# EAGLE design pqc-rev2 (EAGLE 9.0.1)
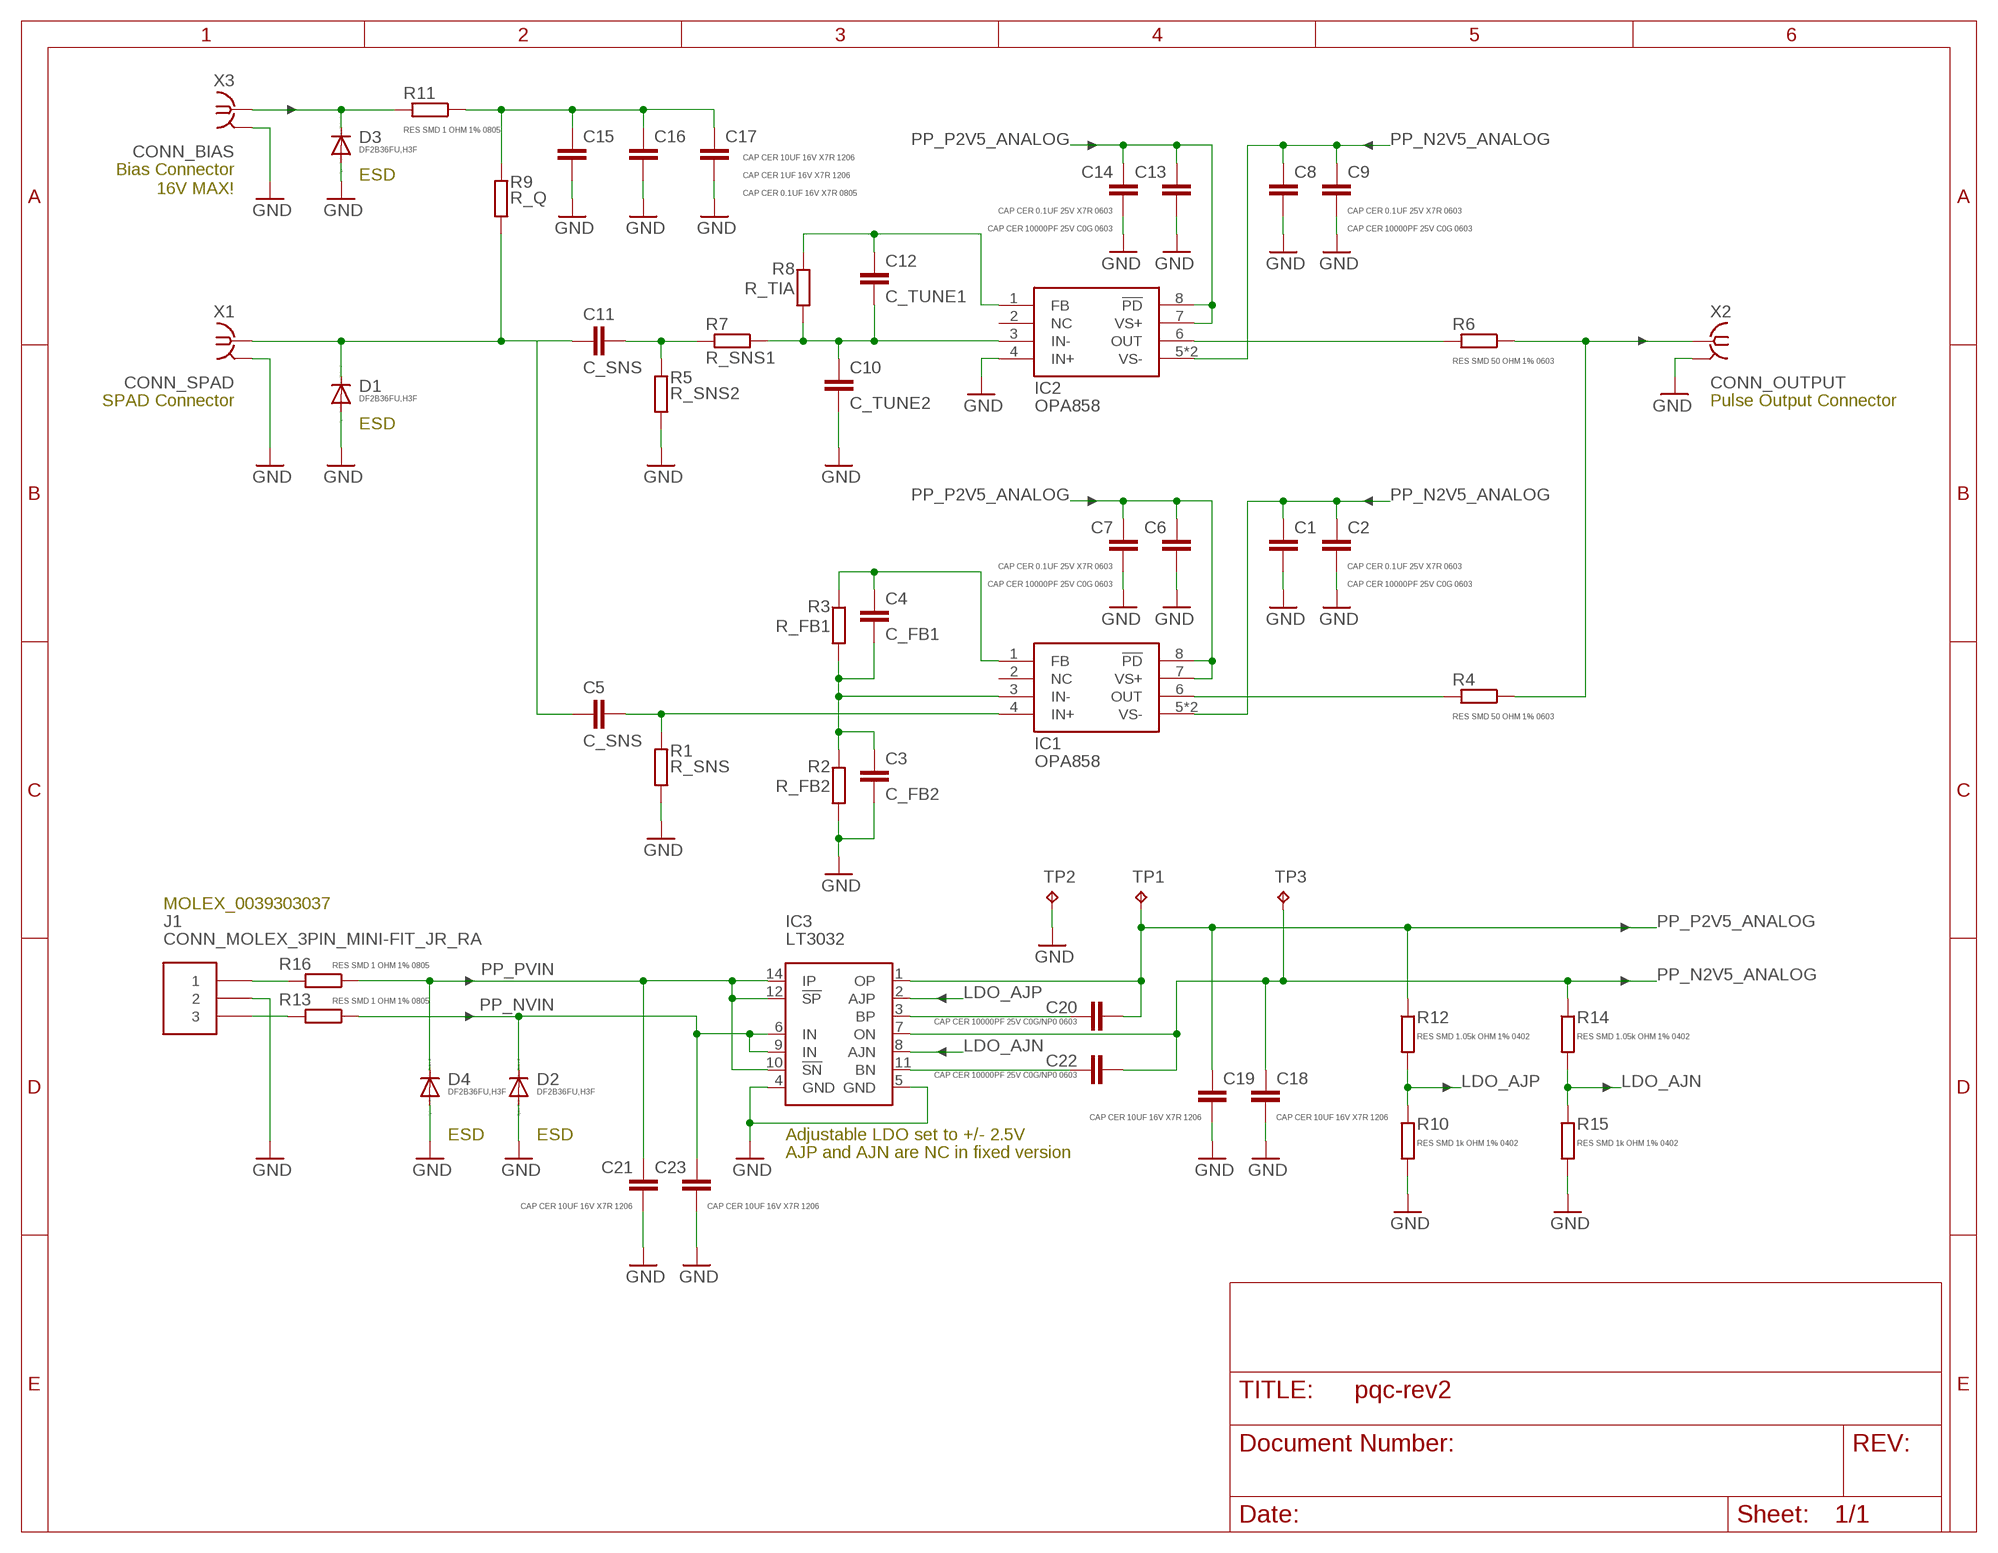
[diagram p0: schematic, sheet 1]

## Parts
C1  CAP CER 10000PF 25V C0G 0603  C-EUC0603  [C0603]
C2  CAP CER 0.1UF 25V X7R 0603  C-EUC0603  [C0603]
C3  C_FB2  C-EUC0402  [C0402]
C4  C_FB1  C-EUC0402  [C0402]
C5  C_SNS  C-EUC0603  [C0603]
C6  CAP CER 10000PF 25V C0G 0603  C-EUC0603  [C0603]
C7  CAP CER 0.1UF 25V X7R 0603  C-EUC0603  [C0603]
C8  CAP CER 10000PF 25V C0G 0603  C-EUC0603  [C0603]
C9  CAP CER 0.1UF 25V X7R 0603  C-EUC0603  [C0603]
C10  C_TUNE2  C-EUC0402  [C0402]
C11  C_SNS  C-EUC0603  [C0603]
C12  C_TUNE1  C-EUC0402  [C0402]
C13  CAP CER 10000PF 25V C0G 0603  C-EUC0603  [C0603]
C14  CAP CER 0.1UF 25V X7R 0603  C-EUC0603  [C0603]
C15  CAP CER 0.1UF 16V X7R 0805  C-EUC0805  [C0805]
C16  CAP CER 1UF 16V X7R 1206  C-EUC1206  [C1206]
C17  CAP CER 10UF 16V X7R 1206  C-EUC1206  [C1206]
C18  CAP CER 10UF 16V X7R 1206  C-EUC1206  [C1206]
C19  CAP CER 10UF 16V X7R 1206  C-EUC1206  [C1206]
C20  CAP CER 10000PF 25V C0G/NP0 0603  C-EUC0603  [C0603]
C21  CAP CER 10UF 16V X7R 1206  C-EUC1206  [C1206]
C22  CAP CER 10000PF 25V C0G/NP0 0603  C-EUC0603  [C0603]
C23  CAP CER 10UF 16V X7R 1206  C-EUC1206  [C1206]
D1  DF2B36FU,H3F  DIODE-SOD323-W  [SOD323-W]
D2  DF2B36FU,H3F  DIODE-SOD323-W  [SOD323-W]
D3  DF2B36FU,H3F  DIODE-SOD323-W  [SOD323-W]
D4  DF2B36FU,H3F  DIODE-SOD323-W  [SOD323-W]
IC1  OPA858  [WSON8]
IC2  OPA858  [WSON8]
IC3  LT3032  [DFN14-4X3DE]
J1  CONN_MOLEX_3PIN_MINI-FIT_JR_RA  [CONN_MOLEX_3PIN_MINI-FIT_JR_RA]
R1  R_SNS  R-EU_R0402  [R0402]
R2  R_FB2  R-EU_R0402  [R0402]
R3  R_FB1  R-EU_R0402  [R0402]
R4  RES SMD 50 OHM 1% 0603  R-EU_R0603  [R0603]
R5  R_SNS2  R-EU_R0402  [R0402]
R6  RES SMD 50 OHM 1% 0603  R-EU_R0603  [R0603]
R7  R_SNS1  R-EU_R0402  [R0402]
R8  R_TIA  R-EU_R0402  [R0402]
R9  R_Q  R-EU_R0805  [R0805]
R10  RES SMD 1k OHM 1% 0402  R-EU_R0402  [R0402]
R11  RES SMD 1 OHM 1% 0805  R-EU_R0805  [R0805]
R12  RES SMD 1.05k OHM 1% 0402  R-EU_R0402  [R0402]
R13  RES SMD 1 OHM 1% 0805  R-EU_R0805  [R0805]
R14  RES SMD 1.05k OHM 1% 0402  R-EU_R0402  [R0402]
R15  RES SMD 1k OHM 1% 0402  R-EU_R0402  [R0402]
R16  RES SMD 1 OHM 1% 0805  R-EU_R0805  [R0805]
TP1  P2V5  TPTP20R  [TP20R]
TP2  GND  TPTP20R  [TP20R]
TP3  N2V5  TPTP20R  [TP20R]
X1  CONN_SPAD  SMA-142-0701-881/886  [J502-ND-142-0701-881/886]
X2  CONN_OUTPUT  SMA-142-0701-881/886  [J502-ND-142-0701-881/886]
X3  CONN_BIAS  SMA-142-0701-881/886  [J502-ND-142-0701-881/886]

## Nets
GND: C1.2 C2.2 C3.2 C6.2 C7.2 C8.2 C9.2 C10.2 C13.2 C14.2 C15.2 C16.2 C17.2 C18.2 C19.2 C21.2 C23.2 D1.A D2.A D3.A D4.A IC2.4(IN+) IC3.4(GND) IC3.5(GND) J1.2 R1.1 R2.2 R5.1 R10.2 R15.2 TP2.TP X1.G@1(GND) X2.G@1(GND) X3.G@1(GND)
LDO_AJN: IC3.8(AJN) R14.2 R15.1
LDO_AJP: IC3.2(AJP) R10.1 R12.2
N$1: C15.1 C16.1 C17.1 R9.2 R11.1
N$2: C5.1 C11.1 D1.C R9.1 X1.1
N$3: C11.2 R5.2 R7.2
N$4: C10.1 C12.2 IC2.3(IN-) R7.1 R8.2
N$5: C12.1 IC2.1(FB) R8.1
N$6: C5.2 IC1.4(IN+) R1.2
N$7: IC2.6(OUT) R6.2
N$8: C20.1 IC3.3(BP)
N$9: C22.1 IC3.11(BN)
N$10: C3.1 C4.2 IC1.3(IN-) R2.1 R3.2
N$11: C4.1 IC1.1(FB) R3.1
N$12: R4.1 R6.1 X2.1
N$13: D3.C R11.2 X3.1
N$16: IC1.6(OUT) R4.2
PP_N2V5_ANALOG: C1.1 C2.1 C8.1 C9.1 C18.1 C22.2 IC1.5(VS-) IC1.PAD(VS-) IC2.5(VS-) IC2.PAD(VS-) IC3.7(ON) R14.1 TP3.TP
PP_NVIN: C23.1 D2.C IC3.6(IN) IC3.9(IN) R13.1
PP_NVIN_CONN: J1.3 R13.2
PP_P2V5_ANALOG: C6.1 C7.1 C13.1 C14.1 C19.1 C20.2 IC1.7(VS+) IC1.8(!PD) IC2.7(VS+) IC2.8(!PD) IC3.1(OP) R12.1 TP1.TP
PP_PVIN: C21.1 D4.C IC3.10(!SN) IC3.12(!SP) IC3.14(IP) R16.1
PP_PVIN_CONN: J1.1 R16.2
Unconnected: IC1.2(NC) IC2.2(NC)

## Notes on the sheet
- Bias Connector
  16V MAX!
- ESD
- SPAD Connector | Pulse Output Connector
- ESD
- MOLEX_0039303037
- ESD | ESD | Adjustable LDO set to +/- 2.5V
- AJP and AJN are NC in fixed version

## Power pins joined to a net without a drawn wire
GND: X1.G@2(GND) X1.G@3(GND) X1.G@4(GND) X2.G@2(GND) X2.G@3(GND) X2.G@4(GND) X3.G@2(GND) X3.G@3(GND) X3.G@4(GND)

## Library data of the parts
C1-C14 = rcl-modified-footprints:C-EU: CAPACITOR, European symbol
C15-C23 = rcl:C-EU: CAPACITOR, European symbol
D1-D4 = diode:DIODE-: DIODE
IC1 IC2 = meng:OPA858
IC3 = meng:LT3032: LT3032 dual postive/negative LDO linear regulator
J1 = meng:CONN_MOLEX_3PIN_MINI-FIT_JR
R1-R8 R10 R12-R16 = rcl-modified-footprints:R-EU_: RESISTOR, European symbol
R9 R11 = rcl:R-EU_: RESISTOR, European symbol; SPICEPREFIX: R
TP1-TP3 = testpad:TP: Test pad
X1-X3 = meng:SMA-: SMA 50 Ohm End Launch Jack Receptacle - Round Contact Johnson Components Source: www.johnsoncomponents.com .. J502-ND.pdf; MF: JOHNSON COMPONENTS; MPN: 142-0701-881; OC_FARNELL: 1608603; OC_NEWARK: 08B906

## Net classes
1 100OHM_DIFF: width 0.254 mm, clearance 0.254 mm

## Board
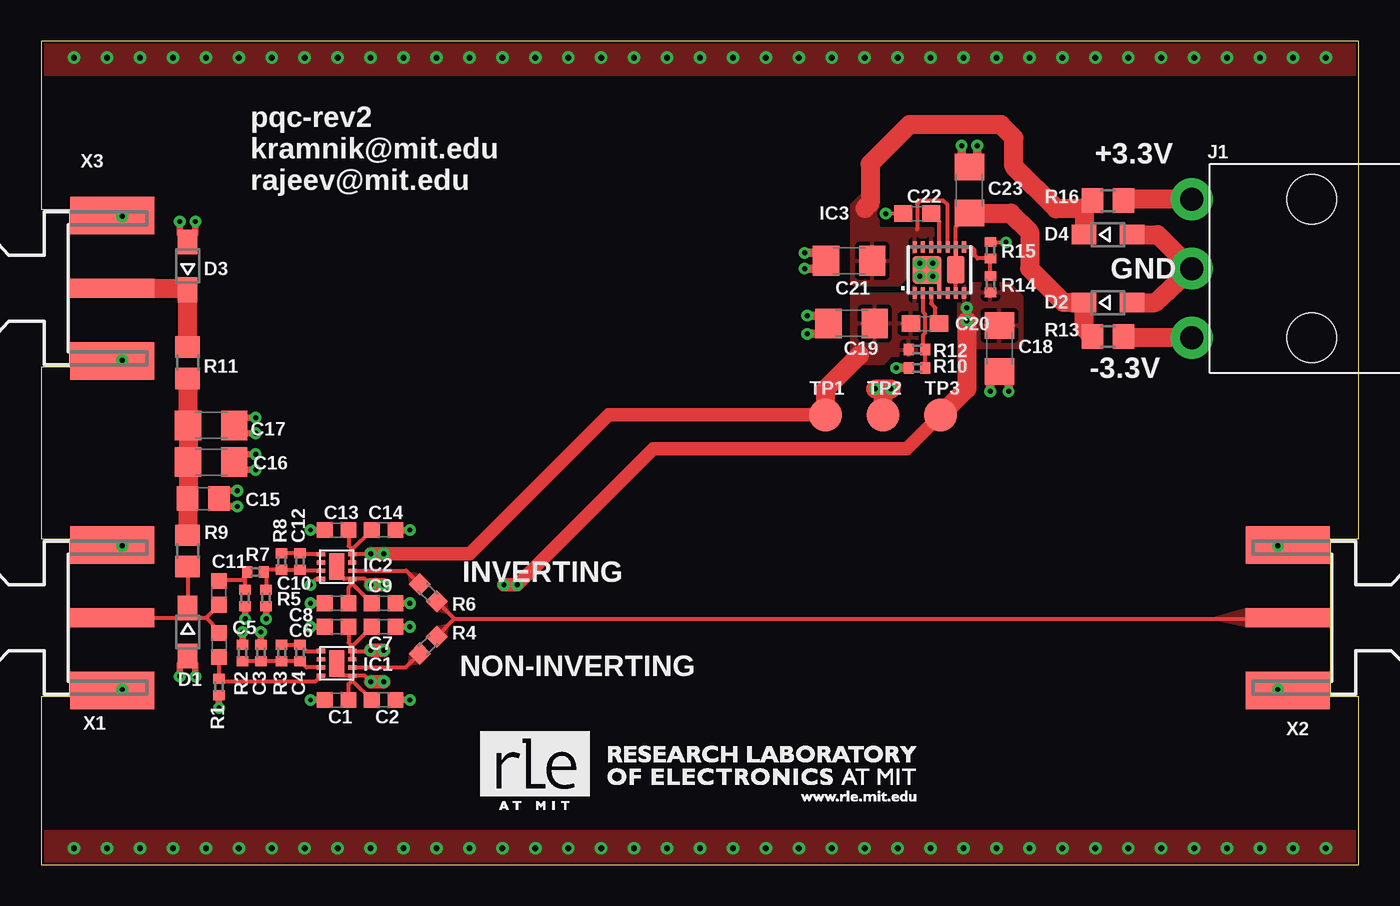
[diagram p1: board, top side]
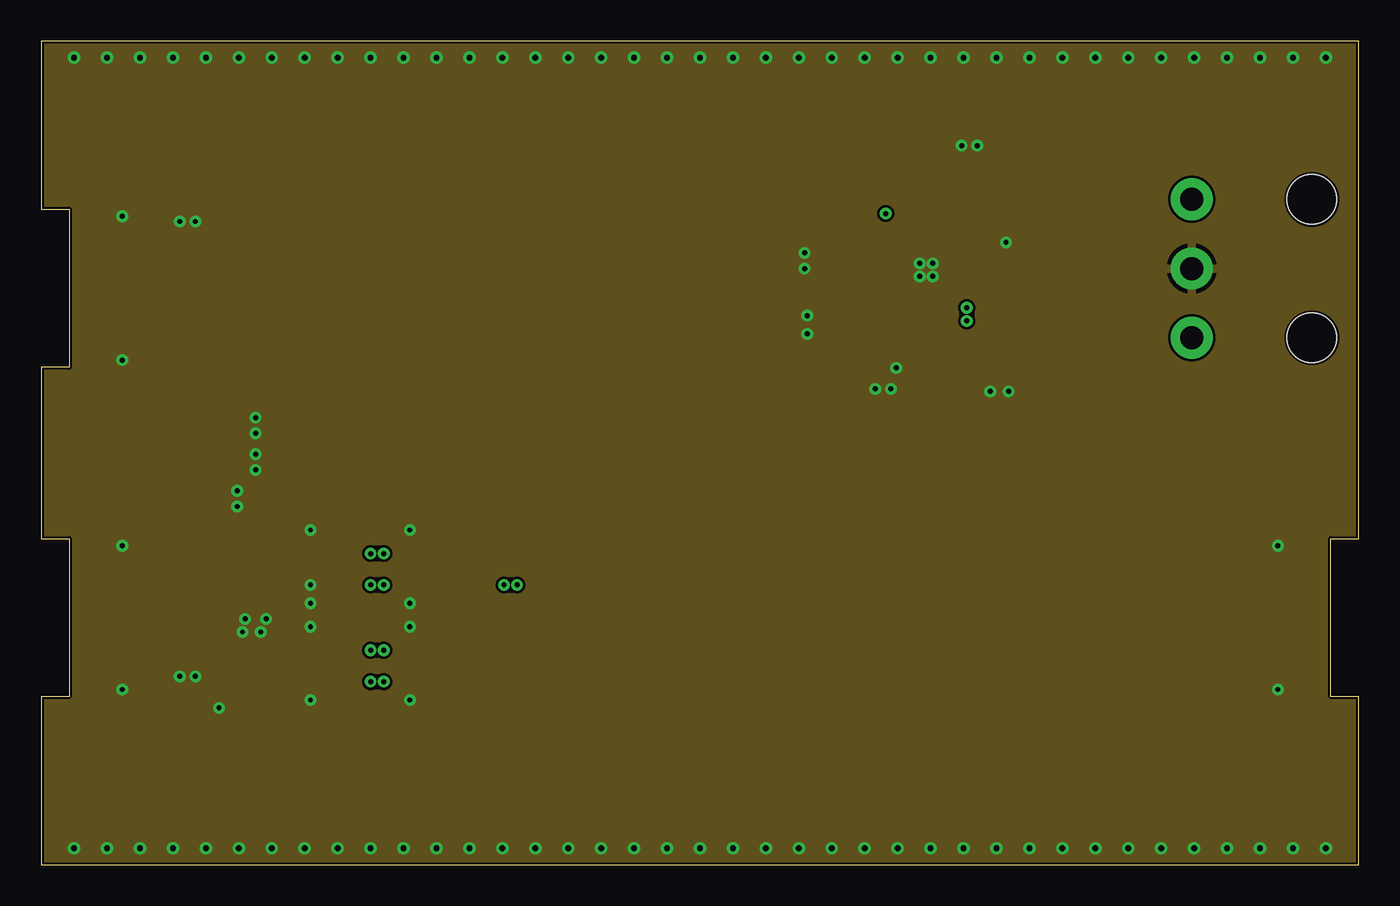
[diagram p2: board, inner layer Route2]
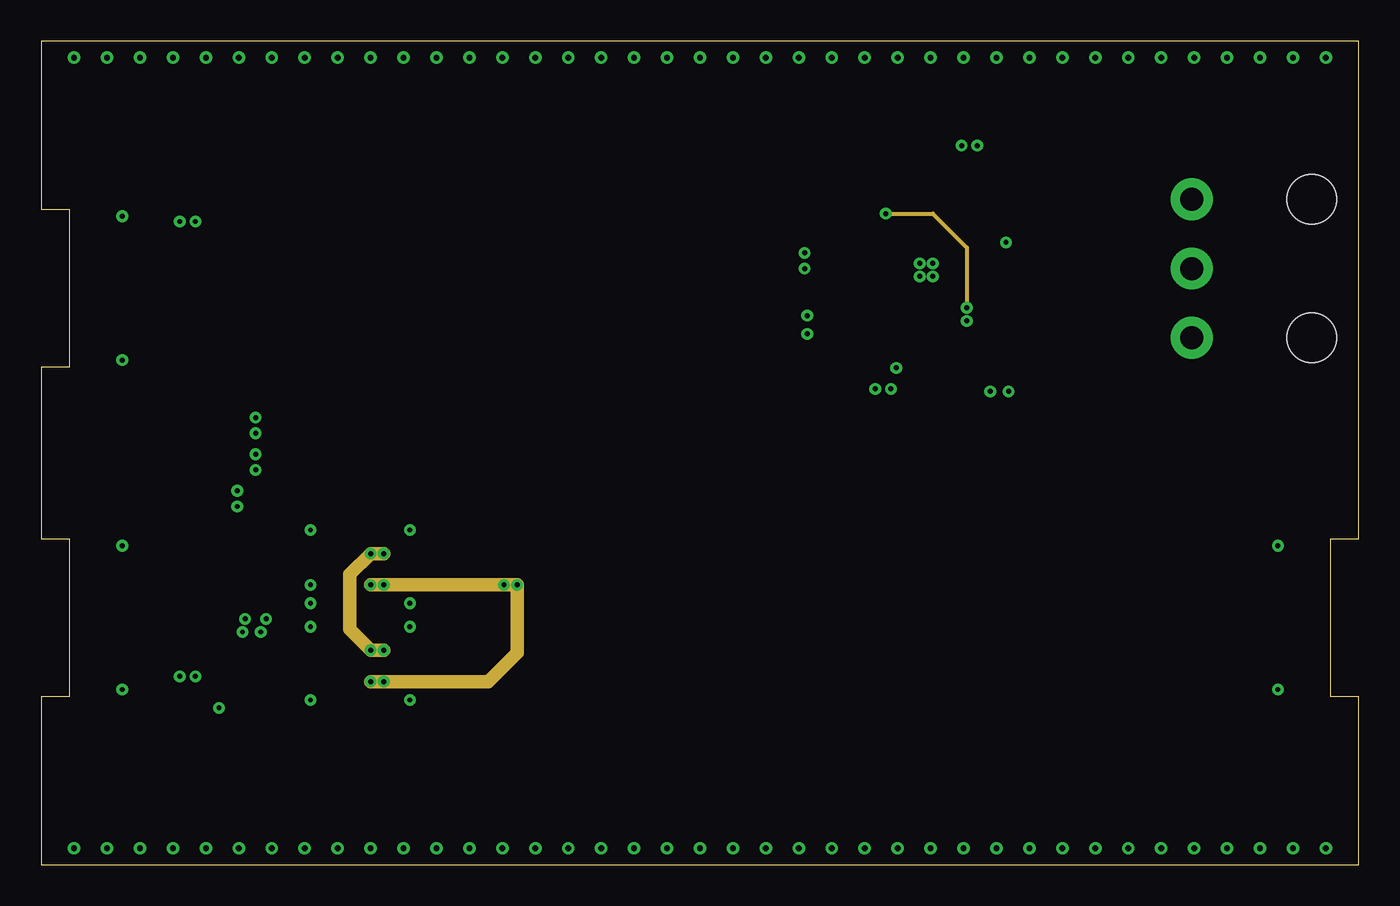
[diagram p3: board, inner layer Route15]
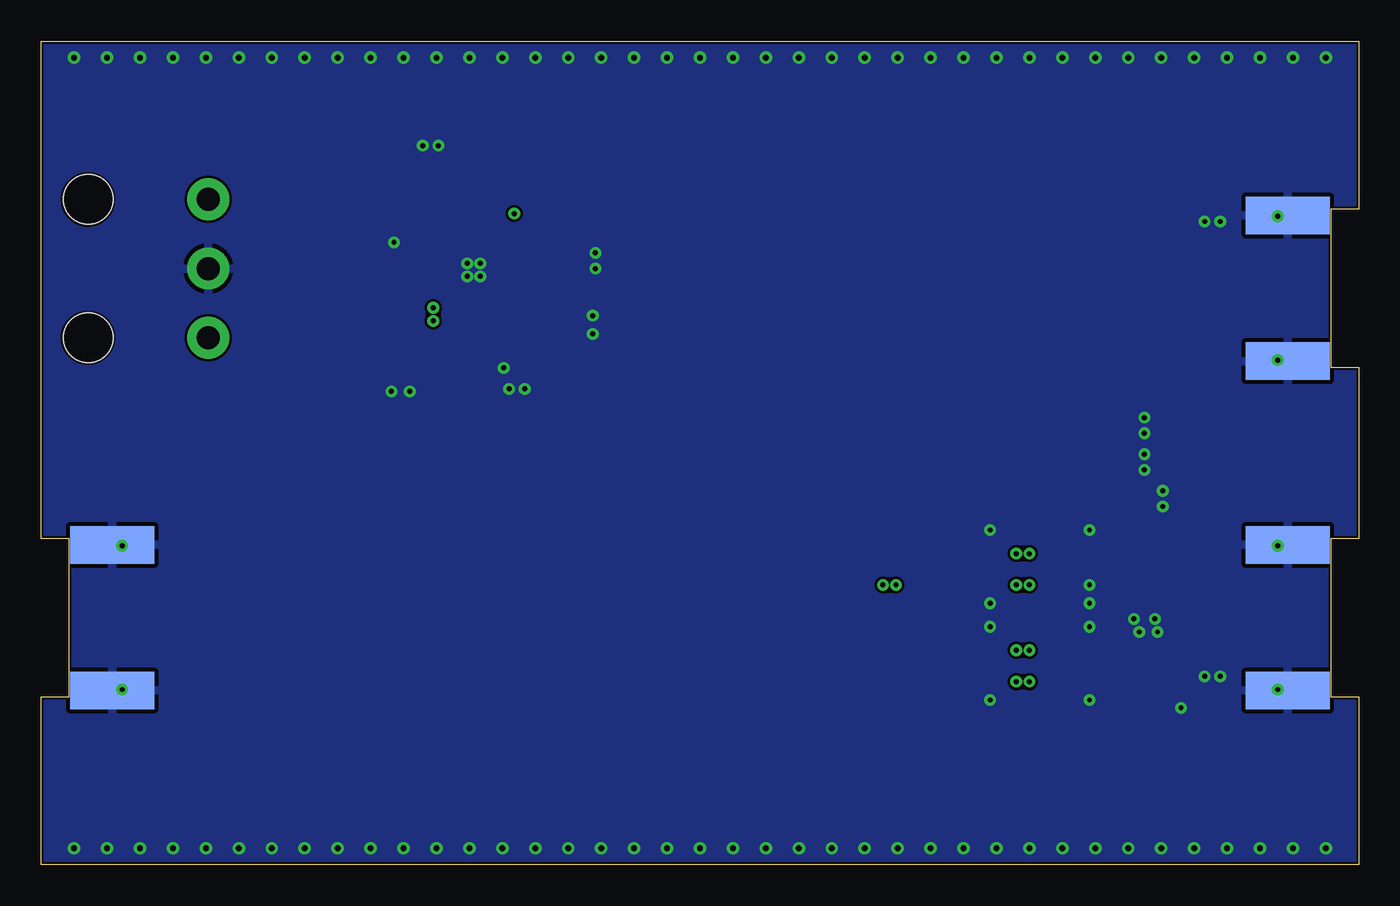
[diagram p4: board, bottom side, seen from below]

Size 80 x 50 mm. Coordinates in mm from the lower left corner, seen from the top.
Outline: 0,0 80,0 80,10.2 78.3,10.2 78.3,19.8 80,19.8 80,50 0,50 0,39.8 1.7,39.8 1.7,30.2 0,30.2 0,19.8 1.7,19.8 1.7,10.2 0,10.2 0,0
Copper layers (1+2*15+16): Top 0.035mm / dielectric 1.5mm / Route2 0.035mm / dielectric 0.15mm / Route15 0.035mm / dielectric 0.2mm / Bottom 0.035mm
Design rules "default *": minimum track width 6mil, minimum drill 0.3mm, track to track 6mil, track to pad 6mil, pad to pad 6mil, via to via 6mil, smd to smd 0mil, copper to edge 6mil, drill to drill 6mil, minimum pad ring 10mil, minimum via ring 8mil, stop-mask expansion 2mil, vias tented up to drill 0.35mm, thermal gap 10mil

### Footprints (pad centres in the part's own frame; a part is rotated, then mirrored left to right if it is on the bottom)
C0603 = smd 0.95 x 0.95: 1 -0.725,0; 2 0.725,0
C0402 = smd 0.6 x 0.7: 1 -0.5,0; 2 0.5,0
C0805 = smd 1.3 x 1.5: 1 -0.95,0; 2 0.95,0
C1206 = smd 1.6 x 1.8: 1 -1.4,0; 2 1.4,0
C0603' = smd 1.1 x 1: 1 -0.85,0; 2 0.85,0
SOD323-W = smd 1.5 x 1.2: A 1.45,0; C -1.45,0
WSON8 = smd 0.5 x 0.25: 1 -0.95,0.75; 2 -0.95,0.25; 3 -0.95,-0.25; 4 -0.95,-0.75; 5 0.95,-0.75; 6 0.95,-0.25; 7 0.95,0.25; 8 0.95,0.75 | smd 0.9 x 1.6: PAD 0,0
DFN14-4X3DE = smd 0.25 x 0.7: 1 -1.5,-1.4; 2 -1,-1.4; 3 -0.5,-1.4; 5 0.5,-1.4; 6 1,-1.4; 7 1.5,-1.4; 8 1.5,1.4; 10 0.5,1.4; 11 0,1.4; 12 -0.5,1.4; 13 -1,1.4; 14 -1.5,1.4 | smd 0.25 x 2: 4 0,-0.75; 9 1,0.75 | smd 1.75 x 1.65: 4@1 -0.75,0 | smd 1.07 x 1.65: 9@2 1,0
CONN_MOLEX_3PIN_MINI-FIT_JR_RA = drill 1.4 pad 2.54: 1 4.2,0; 2 0,0; 3 -4.2,0 | hole 3: 4.2,-7.3; -4.2,-7.3
R0402 = smd 0.6 x 0.7: 1 -0.5,0; 2 0.5,0
R0603 = smd 0.95 x 0.95: 1 -0.725,0; 2 0.725,0
R0805 = smd 1.3 x 1.5: 1 -0.95,0; 2 0.95,0
TP20R = smd 2 x 2: TP 0,0
J502-ND-142-0701-881/886 = smd 5.08 x 1.143: 1 2.565,0 | smd 5.08 x 2.286: G@1 2.565,4.42; G@2 2.565,-4.42 | smd 5.08 x 2.286 bottom: G@3 2.565,4.42; G@4 2.565,-4.42

### Placement (x,y rotation side)
C1  17.94,10 180 top
C2  20.8,10 0 top
C3  13.34,12.86 90 top
C4  15.72,12.86 270 top
C5  10.79,13.34 270 top
C6  17.94,14.45 180 top
C7  20.8,14.45 0 top
C8  17.94,15.88 180 top
C9  20.8,15.88 0 top
C10  13.65,16.19 270 top
C11  10.79,16.51 90 top
C12  15.72,18.41 270 top
C13  17.94,20.32 180 top
C14  20.8,20.32 0 top
C15  9.84,22.23 0 top
C16  10.32,24.45 0 top
C17  10.32,26.67 0 top
C18  58.18,31.34 270 top
C19  49.21,32.86 180 top
C20  CAP CER 10000PF 25V C0G/NP0 0603  [C0603']  53.66,32.86 180 top
C21  49.05,36.67 180 top
C22  CAP CER 10000PF 25V C0G/NP0 0603  [C0603']  53.18,39.53 180 top
C23  56.36,40.96 90 top
D1  8.89,14.13 270 top
D2  64.77,34.13 0 top
D3  8.89,36.35 90 top
D4  64.77,38.26 0 top
IC1  17.94,12.22 0 top
IC2  17.94,18.1 0 top
IC3  54.53,36.12 0 top
J1  69.85,36.2 90 top
R1  10.79,10.79 90 top
R2  12.22,12.86 90 top
R3  14.61,12.86 270 top
R4  23.5,13.34 225 top
R5  12.38,16.19 90 top
R6  23.5,16.51 135 top
R7  13.02,17.78 180 top
R8  14.61,18.41 270 top
R9  8.89,19.05 90 top
R10  53.18,30.16 180 top
R11  8.89,30.48 90 top
R12  53.18,31.27 0 top
R13  64.77,32.07 0 top
R14  57.63,35.24 90 top
R15  57.63,37.31 90 top
R16  64.77,40.32 0 top
TP1  47.62,27.3 0 top
TP2  51.12,27.3 0 top
TP3  54.61,27.3 0 top
X1  1.75,15 0 top
X2  78.25,15 180 top
X3  1.75,35 0 top

### Tracks (layer width: path | path; a pad name or v marks a point on that pad's centre or on a via)
GND  (via drill 0.3, 0.35)
  Top 0.254: v16.35,16.99 16.71,17.35 IC2.4 | IC3.5 54.53,34.72 IC3.4 54.29,35.61 v54.13,35.72 | R15.2 58.55,37.81 v58.58,37.78 | X2.G@3 75.63,10.64 v75.09,10.64 | X2.G@4 75.64,19.37 v75.09,19.37 | X1.G@4 4.37,10.64 v4.92,10.64 | X1.G@1 4.36,19.37 v4.92,19.37 | X3.G@3 4.36,39.37 v4.92,39.37 | X3.G@4 4.37,30.64 v4.92,30.64
  Top 0.406: C8.2 v16.35,15.88 | C6.2 v16.35,14.45 | C10.2 v13.65,14.92 | R5.1 v12.38,14.92 | R2.2 v12.22,14.13 | C3.2 v13.34,14.13 | R1.1 v10.79,9.53 | C1.2 v16.35,10 | C2.2 v22.38,10 | C7.2 v22.38,14.45 | C9.2 v22.38,15.88 | C14.2 v22.38,20.32 | C13.2 v16.35,20.32 | v13.02,24.92 12.2,24.92 11.81,24.54 | 11.81,24.54 C16.2 | v13.02,23.97 12.38,23.97 11.81,24.54 | v8.41,39.05 8.41,38.28 D3.A 9.37,38.28 v9.37,39.05 | v11.91,22.7 11.27,22.7 C15.2 11.27,21.75 v11.91,21.75 | v13.02,26.19 12.2,26.19 C17.2 12.2,27.15 v13.02,27.15 | D1.A 9.21,12.36 | D1.A 8.41,12.2 v8.41,11.43 | D1.A 9.37,12.2 v9.37,11.43
  Top 0.508: v51.91,30.16 R10.2 | v57.63,28.73 57.63,29.7 C18.2 58.74,29.7 v58.74,28.73 | v46.51,33.34 47.34,33.34 C19.2 47.18,32.23 v46.51,32.23 | v46.35,37.15 47.18,37.15 C21.2 47.18,36.2 v46.35,36.2 | v56.83,43.66 56.83,42.83 C23.2 55.88,42.83 v55.88,43.66
  Top 1.143: D4.A 67.79,38.26 J1.2 67.63,34.13 D2.A | v50.64,28.89 51.12,28.89 | 51.12,28.89 v51.59,28.89 | TP2.TP 51.12,28.89
  other vias: 53.34,35.72 53.34,36.51 54.13,36.51 2,49 4,49 6,49 8,49 10,49 12,49 14,49 16,49 18,49 20,49 22,49 24,49 26,49 28,49 30,49 32,49 34,49 36,49 38,49 40,49 42,49 44,49 46,49 48,49 50,49 52,49 54,49 56,49 58,49 60,49 62,49 64,49 66,49 68,49 70,49 72,49 74,49 76,49 78,49 2,1 4,1 6,1 8,1 10,1 12,1 14,1 16,1 18,1 20,1 22,1 24,1 26,1 28,1 30,1 32,1 34,1 36,1 38,1 40,1 42,1 44,1 46,1 48,1 50,1 52,1 54,1 56,1 58,1 60,1 62,1 64,1 66,1 68,1 70,1 72,1 74,1 76,1 78,1
  pour Bottom: -1,51 80,51 81,51 81,-1 -1,-1
  pour Route2 (rank 6): -2,52 82,52 82,-2 -2,-2
  pour Top: 0,50 80,50 80,48 0,48
  pour Top: 0,2 80,2 80,0 0,0
LDO_AJN
  Top 0.254: R14.2 R15.1 56.86,36.81 56.67,36.99 56.67,37.31 56.46,37.52 IC3.8
LDO_AJP
  Top 0.254: R10.1 R12.2 53.53,31.42 53.53,32.14 53.64,32.25 53.64,33.48 53.53,33.58 IC3.2
N$1
  Top 1.143: R11.1 8.89,26.7 C17.1 C16.1 8.92,22.25 C15.1 R9.2
N$2
  Top 0.254: X1.1 8.89,15 | 8.89,15 10.01,15 | 10.01,15 C11.1 | C5.1 10.79,14.21 10.01,15 | 8.89,15 8.91,15.02 D1.C R9.1
N$3
  Top 0.254: R5.2 12.38,17.3 | 12.38,17.3 12.38,17.64 R7.2 | C11.2 10.86,17.3 12.38,17.3
N$4
  Top 0.254: IC2.3 15.78,17.85 C12.2 R8.2 13.65,17.91 R7.1 13.65,17.64 C10.1
N$5
  Top 0.254: IC2.1 15.78,18.85 C12.1 R8.1
N$6
  Top 0.254: IC1.4 16.63,11.11 10.98,11.11 R1.2 C5.2
N$7
  Top 0.254: IC2.6 22.16,17.85 R6.2
  pour Top (no thermals): 22.23,17.78 22.38,16.99 23.02,17.62
N$8
  Top 0.254: IC3.3 54.03,34.08 54.29,33.81 54.29,33.08 C20.1
N$9
  Top 0.254: IC3.11 54.53,39.03 C22.1
N$10
  Top 0.254: IC1.3 16.1,11.97 C4.2 R3.2 C3.1 R2.1
N$11
  Top 0.254: R3.1 C4.1 16.1,12.97 IC1.1
N$12
  Top 0.254: R6.1 25.08,14.92 | R4.1 25.08,14.92 | 25.08,14.92 | X2.1 75.61,14.92 25.08,14.92
  pour Top (no thermals): 24.77,15.24 24.61,16.03 23.97,15.4
  pour Top (no thermals): 24.77,14.61 23.97,14.45 24.61,13.81
  pour Top (no thermals): 73.18,15.56 70.96,14.92 73.18,14.45
N$13
  Top 1.143: X3.1 8.79,35 D3.C R11.2
N$16
  Top 0.254: IC1.6 22.13,11.97 R4.2
  pour Top (no thermals): 22.23,12.06 23.02,12.22 22.38,12.86
PP_N2V5_ANALOG  (via drill 0.3)
  Top 0.254: IC2.PAD 18.26,17.78 18.26,17.46 18.37,17.35 IC2.5 | IC1.5 18.05,11.47 17.94,11.59 IC1.PAD | IC1.5 18.89,11.18 | 18.89,11.18 C2.1 | C1.1 18.66,10.96 18.89,11.18 | IC2.5 18.89,17.06 | 18.89,17.06 C9.1 | C8.1 18.66,16.83 18.89,17.06 | v20,11.11 19.64,11.47 IC1.5 | v20,16.99 19.64,17.35 IC2.5 | 57.6,34.72 R14.1 | C22.2 v51.28,39.53
  Top 0.813: v20,16.99 v20.8,16.99 | v20,11.11 v20.8,11.11 | TP3.TP 52.55,25.24 37.15,25.24 v28.89,16.99 v28.1,16.99
  Top 1.143: v56.2,33.02 56.2,28.89 TP3.TP
  Route15 0.254: v51.28,39.53 54.13,39.53 56.2,37.47 v56.2,33.81
  Route15 0.813: v20,11.11 v20.8,11.11 27.15,11.11 28.89,12.86 v28.89,16.99 v28.1,16.99 v20.8,16.99 v20,16.99
  pour Top: 55.72,35.24 55.72,31.91 56.2,31.43 59.37,31.43 59.53,31.59 59.53,34.45 58.74,35.24
PP_NVIN
  Top 0.254: IC3.6 IC3.9 55.53,38.73 C23.1
  Top 1.143: R13.1 63.32,32.57 D2.C 62.07,34.13 60.01,36.2 60.01,38.42 58.87,39.56 C23.1
PP_NVIN_CONN
  Top 1.143: J1.3 65.79,32 R13.2
PP_P2V5_ANALOG  (via drill 0.3)
  Top 0.254: IC1.8 18.89,13.26 | 18.89,13.26 C7.1 | C6.1 18.66,13.49 18.89,13.26 | IC1.7 IC1.8 | IC2.8 18.89,19.14 | 18.89,19.14 C14.1 | C13.1 18.66,19.36 18.89,19.14 | IC2.7 IC2.8 | IC1.8 19.96,12.97 v20,13.02 | v20,18.89 19.96,18.85 IC2.8 | 53.03,33.09 C20.2 | 52.81,31.4 R12.1
  Top 0.813: TP1.TP 34.45,27.3 26.04,18.89 v20.8,18.89 v20,18.89 | v20,13.02 v20.8,13.02
  Top 1.143: TP1.TP 47.62,28.89 49.69,30.96
  Route15 0.813: v20.8,18.89 v20,18.89 18.73,17.62 18.73,14.29 v20,13.02 v20.8,13.02
  pour Top: 53.34,35.24 53.02,35.24 52.39,34.61 49.37,34.61 49.21,34.45 49.21,30.64 49.37,30.48 51.12,30.48 51.59,30.96 53.02,30.96 53.18,31.11 53.18,33.18 53.34,33.34
PP_PVIN
  Top 0.254: IC3.10 55.03,40.06 54.77,40.32 54.75,40.31 53.37,40.31 53.18,40.12 53.18,38.58
  Top 1.143: R16.1 63.32,39.82 | 63.32,39.82 D4.C | 63.32,39.82 61.62,39.82 59.05,42.39 59.05,44.13 58.26,44.93 52.7,44.93 50.32,42.55 50.32,40.16 50.01,39.85
  pour Top: 49.37,35.24 52.07,35.24 52.86,36.04 54.13,36.04 54.29,36.2 54.29,38.42 54.13,38.58 50.96,38.58 50.8,38.73 50.8,40.48 50.64,40.64 49.85,40.64 49.21,40.01 49.21,35.4
PP_PVIN_CONN
  Top 1.143: J1.1 65.79,40.4 R16.2

### Text on the board
tPlace: +3.3V | pqc-rev2 / kramnik@mit.edu / rajeev@mit.edu | GND | -3.3V | INVERTING | NON-INVERTING